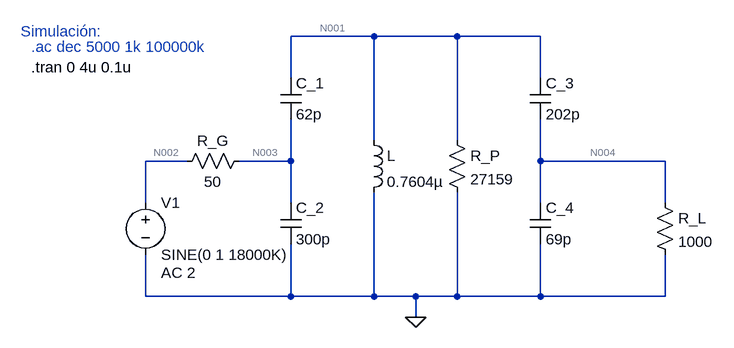
[diagram p0: schematic TP1 - Simulación.asc]
TP1 - Simulación.asc, the LTspice schematic file:
Version 4
SHEET 1 900 680
WIRE 368 -128 240 -128
WIRE 496 -128 368 -128
WIRE 624 -128 496 -128
WIRE 240 -64 240 -128
WIRE 624 -64 624 -128
WIRE 368 32 368 -128
WIRE 496 32 496 -128
WIRE 80 64 16 64
WIRE 240 64 240 0
WIRE 240 64 160 64
WIRE 624 64 624 0
WIRE 816 64 624 64
WIRE 16 128 16 64
WIRE 240 128 240 64
WIRE 624 128 624 64
WIRE 816 128 816 64
WIRE 16 272 16 208
WIRE 240 272 240 192
WIRE 240 272 16 272
WIRE 368 272 368 112
WIRE 368 272 240 272
WIRE 432 272 368 272
WIRE 496 272 496 112
WIRE 496 272 432 272
WIRE 624 272 624 192
WIRE 624 272 496 272
WIRE 816 272 816 208
WIRE 816 272 624 272
WIRE 432 304 432 272
FLAG 432 304 0
SYMBOL voltage 16 112 R0
WINDOW 123 24 124 Left 2
WINDOW 39 0 0 Left 0
SYMATTR Value2 AC 2
SYMATTR InstName V1
SYMATTR Value SINE(0 1 18000K)
SYMBOL cap 224 128 R0
SYMATTR InstName C_2
SYMATTR Value 300p
SYMBOL cap 224 -64 R0
SYMATTR InstName C_1
SYMATTR Value 62p
SYMBOL ind 352 16 R0
SYMATTR InstName L
SYMATTR Value 0.7604µ
SYMBOL res 480 16 R0
SYMATTR InstName R_P
SYMATTR Value 27159
SYMBOL cap 608 128 R0
SYMATTR InstName C_4
SYMATTR Value 69p
SYMBOL cap 608 -64 R0
SYMATTR InstName C_3
SYMATTR Value 202p
SYMBOL res 800 112 R0
SYMATTR InstName R_L
SYMATTR Value 1000
SYMBOL res 176 48 R90
WINDOW 0 0 56 VBottom 2
WINDOW 3 32 56 VTop 2
SYMATTR InstName R_G
SYMATTR Value 50
TEXT -176 -136 Left 2 ;Simulación:
TEXT -160 -112 Left 2 ;.ac dec 5000 1k 100000k
TEXT -160 -80 Left 2 !.tran 0 4u 0.1u

The netlist it stands for:
* TP1 - Simulación.asc
V1 N002 0 SINE(0 1 18000K) AC 2
C_2 N003 0 300p
C_1 N001 N003 62p
L N001 0 0.7604µ
R_P N001 0 27159
C_4 N004 0 69p
C_3 N001 N004 202p
R_L N004 0 1000
R_G N003 N002 50
* Simulación:
* .ac dec 5000 1k 100000k
.tran 0 4u 0.1u
.backanno
.end

* Results of the author's LTspice run, read from the files saved beside the schematic
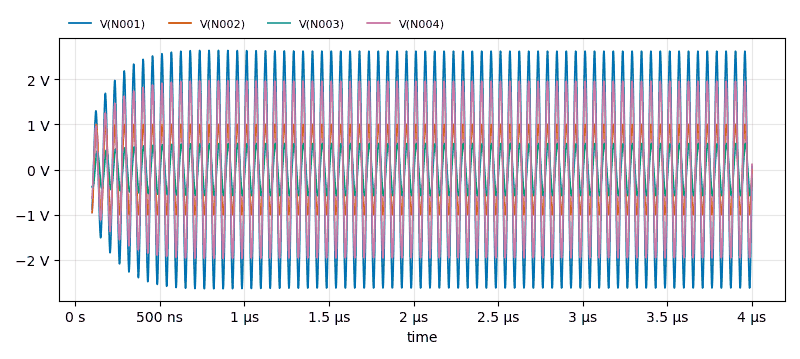
[diagram p1: Transient Analysis of TP1 - Simulación.asc, plotted from the saved traces]
* Transient Analysis, 1 run:
*   V(N001): min -2.637 V, max 2.637 V, average -4.107 mV, rms 1.809 V, last 70.21 mV
*   V(N002): min -998.7 mV, max 999.7 mV, average -1.558 mV, rms 712.2 mV, last 0 V
*   V(N003): min -577.1 mV, max 577.1 mV, average -1.56 mV, rms 401.6 mV, last -206.3 mV
*   V(N004): min -1.966 V, max 1.966 V, average -3.013 mV, rms 1.348 V, last 115.6 mV